# EAGLE design PCB-MIDDLE_FINAL (EAGLE 7.6.0)

## Sheet 1 of 2
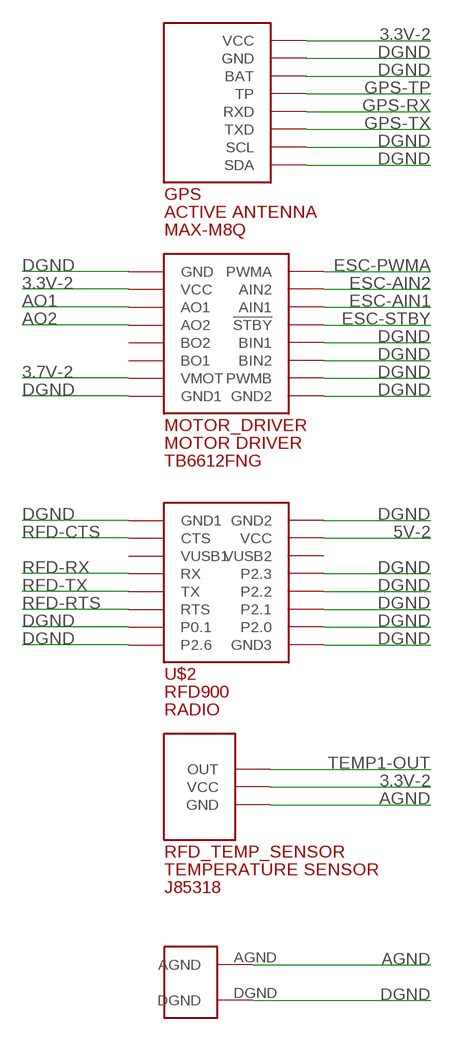
[diagram p0: schematic, sheet 1, part 1 of 2]
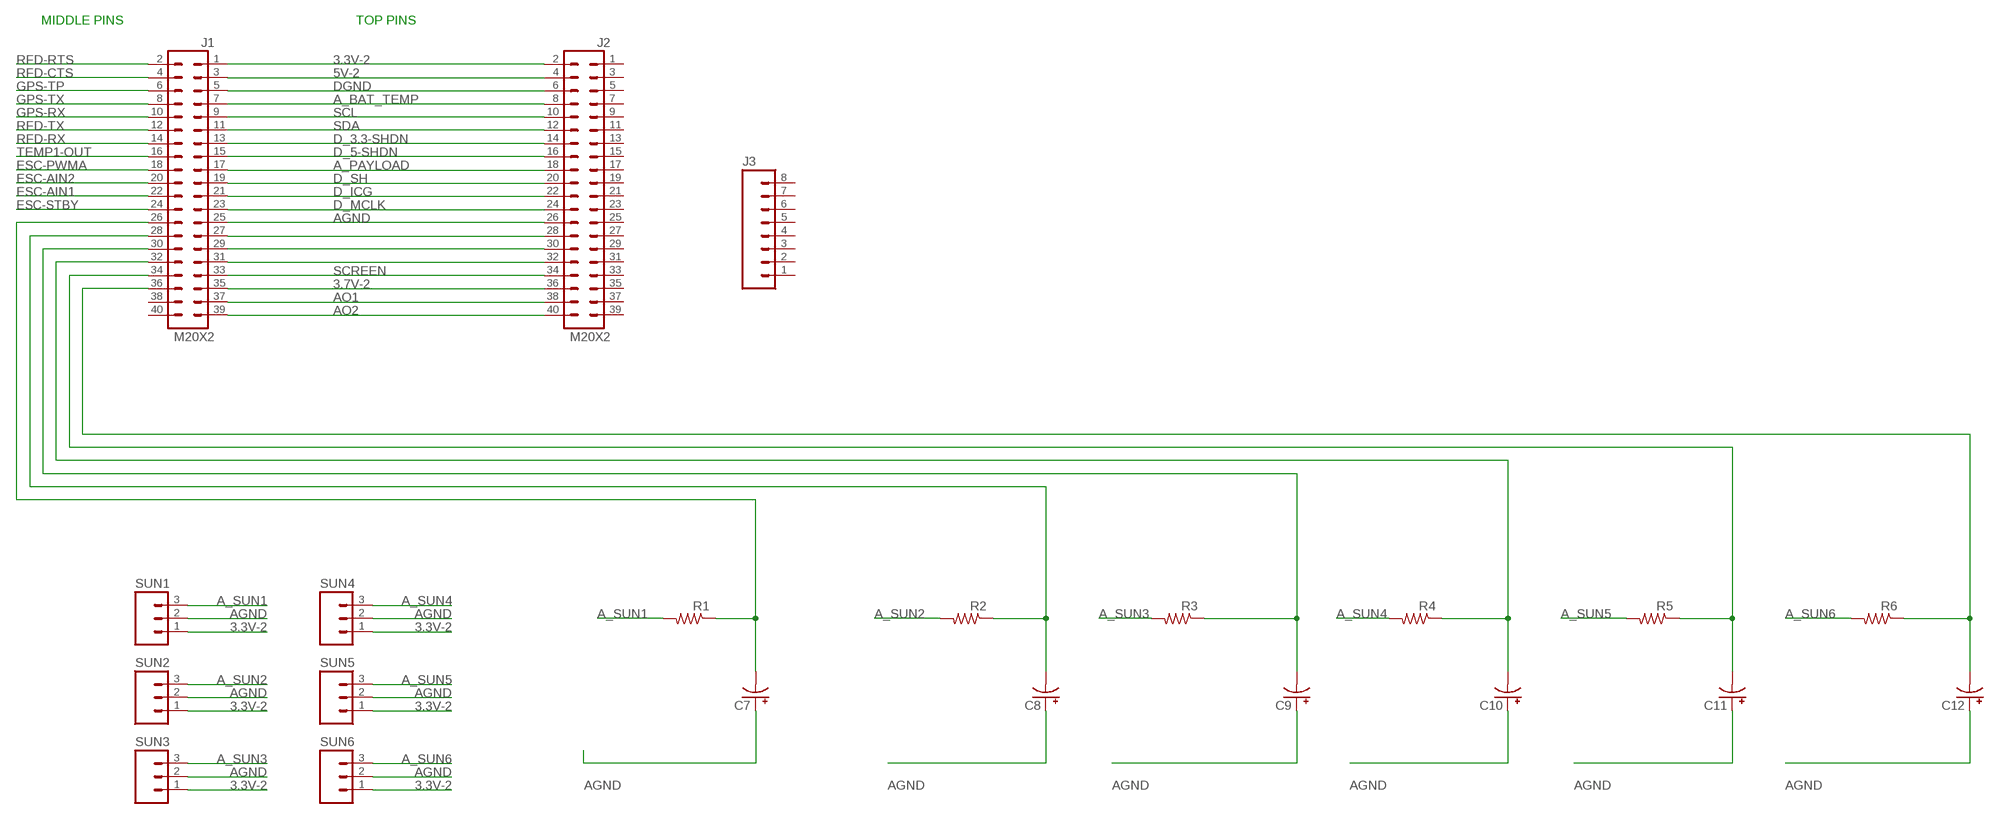
[diagram p1: schematic, sheet 1, part 2 of 2]

### Parts
C7  100UF-25V-20%(PTH)  [CPOL-RADIAL-100UF-25V]
C8  100UF-25V-20%(PTH)  [CPOL-RADIAL-100UF-25V]
C9  100UF-25V-20%(PTH)  [CPOL-RADIAL-100UF-25V]
C10  100UF-25V-20%(PTH)  [CPOL-RADIAL-100UF-25V]
C11  100UF-25V-20%(PTH)  [CPOL-RADIAL-100UF-25V]
C12  100UF-25V-20%(PTH)  [CPOL-RADIAL-100UF-25V]
GPS  MAX-M8QDIP8  [DIP8]
J1  M20X2  [2X20]
J2  M20X2  [2X20]
J3  M08  [1X08_ROUND]
MOTOR_DRIVER  MOTOR_DRIVER_DEV  [MOTOR_DRIVER]
R1  R-US_0204/5  [0204/5]
R2  R-US_0204/5  [0204/5]
R3  R-US_0204/5  [0204/5]
R4  R-US_0204/5  [0204/5]
R5  R-US_0204/5  [0204/5]
R6  R-US_0204/5  [0204/5]
RFD_TEMP_SENSOR  TEMP_SENSORDIP3  [DIP3]
SUN1  M03PTH  [1X03]
SUN2  M03PTH  [1X03]
SUN3  M03PTH  [1X03]
SUN4  M03PTH  [1X03]
SUN5  M03PTH  [1X03]
SUN6  M03PTH  [1X03]
U$1  GROUNDPLANECONNECTION_BOTTOM  [GROUNDPLANECONNECTION_BOTTOM]
U$2  RFD900  [RFD900_NEW]

### Nets
3.3V-2: GPS.VCC J1.1 J2.2 MOTOR_DRIVER.VCC RFD_TEMP_SENSOR.VCC SUN1.1 SUN2.1 SUN3.1 SUN4.1 SUN5.1 SUN6.1
3.7V-2: J1.35 J2.36 MOTOR_DRIVER.VMOT
5V-2: J1.3 J2.4 U$2.VCC
A_BAT_TEMP: J1.7 J2.8
A_PAYLOAD: J1.17 J2.18
A_SUN1: R1.2 SUN1.3
A_SUN2: R2.2 SUN2.3
A_SUN3: R3.2 SUN3.3
A_SUN4: R4.2 SUN4.3
A_SUN5: R5.2 SUN5.3
A_SUN6: R6.2 SUN6.3
AGND: C7.1(+) C8.1(+) C9.1(+) C10.1(+) C11.1(+) C12.1(+) J1.25 J2.26 RFD_TEMP_SENSOR.GND SUN1.2 SUN2.2 SUN3.2 SUN4.2 SUN5.2 SUN6.2 U$1.AGND
AO1: J1.37 J2.38 MOTOR_DRIVER.AO1
AO2: J1.39 J2.40 MOTOR_DRIVER.AO2
D_3.3-SHDN: J1.13 J2.14
D_5-SHDN: J1.15 J2.16
D_ICG: J1.21 J2.22
D_MCLK: J1.23 J2.24
D_SH: J1.19 J2.20
DGND: GPS.BATT(BAT) GPS.GND GPS.SCL GPS.SDA J1.5 J2.6 MOTOR_DRIVER.BIN1 MOTOR_DRIVER.BIN2 MOTOR_DRIVER.GND MOTOR_DRIVER.GND1 MOTOR_DRIVER.GND2 MOTOR_DRIVER.PWMB U$1.DGND U$2.GND1 U$2.GND2 U$2.GND3 U$2.P0.1 U$2.P2.0 U$2.P2.1 U$2.P2.2 U$2.P2.3 U$2.P2.6
ESC-AIN1: J1.22 MOTOR_DRIVER.AIN1
ESC-AIN2: J1.20 MOTOR_DRIVER.AIN2
ESC-PWMA: J1.18 MOTOR_DRIVER.PWMA
ESC-STBY: J1.24 MOTOR_DRIVER.!STBY
GPS-RX: GPS.RXD J1.10
GPS-TP: GPS.TP J1.6
GPS-TX: GPS.TXD J1.8
N$13: J1.27 J2.28
N$14: J1.29 J2.30
N$15: J1.31 J2.32
N$21: C7.2(-) J1.26 R1.1
N$22: C8.2(-) J1.28 R2.1
N$23: C9.2(-) J1.30 R3.1
N$24: C10.2(-) J1.32 R4.1
N$25: C11.2(-) J1.34 R5.1
N$26: C12.2(-) J1.36 R6.1
RFD-CTS: J1.4 U$2.CTS
RFD-RTS: J1.2 U$2.RTS
RFD-RX: J1.14 U$2.RX
RFD-TX: J1.12 U$2.TX
SCL: J1.9 J2.10
SCREEN: J1.33 J2.34
SDA: J1.11 J2.12
TEMP1-OUT: J1.16 RFD_TEMP_SENSOR.OUT
Unconnected: J1.38 J1.40 J2.1 J2.3 J2.5 J2.7 J2.9 J2.11 J2.13 J2.15 J2.17 J2.19 J2.21 J2.23 J2.25 J2.27 J2.29 J2.31 J2.33 J2.35 J2.37 J2.39 J3.1 J3.2 J3.3 J3.4 J3.5 J3.6 J3.7 J3.8 MOTOR_DRIVER.BO1 MOTOR_DRIVER.BO2 U$2.VUSB1 U$2.VUSB2

### Notes on the sheet
- MIDDLE PINS | TOP PINS

## Sheet 2 of 2

## Library data of the parts
C7-C12 = SparkFun-Capacitors:100UF-25V-20%(PTH): CAP-08439; PROD_ID: CAP-08439
GPS = GPS:MAX-M8Q
J1 J2 = SparkFun-Connectors:M20X2: 0.1" spaced headers
J3 = SparkFun-Connectors:M08: Header 8 Standard 8-pin 0.1" header. Use with straight break away headers (SKU : PRT-00116), right angle break away headers (PRT-00553), swiss pins (PRT-00743), machine pins (PRT-00117), and female headers (PRT-00115).; PROD_ID: CONN-08437
MOTOR_DRIVER = Motor_Driver_TB6612FNG:MOTOR_DRIVER_DEV
R1-R6 = resistor:R-US_: RESISTOR, American symbol
RFD_TEMP_SENSOR = Temp_Sensor_K853518:TEMP_SENSOR
SUN1-SUN6 = SparkFun-Connectors:M03: Header 3 Standard 3-pin 0.1" header. Use with straight break away headers (SKU : PRT-00116), right angle break away headers (PRT-00553), swiss pins (PRT-00743), machine pins (PRT-00117), and female headers (PRT-00115). Molex polarized connector foot print use with SKU : PRT-08232 with associated crimp pins and housings.
U$1 = BOTTOM_Groundplaneconnection:GROUNDPLANECONNECTION_BOTTOM
U$2 = RFD900:RFD900

## Board
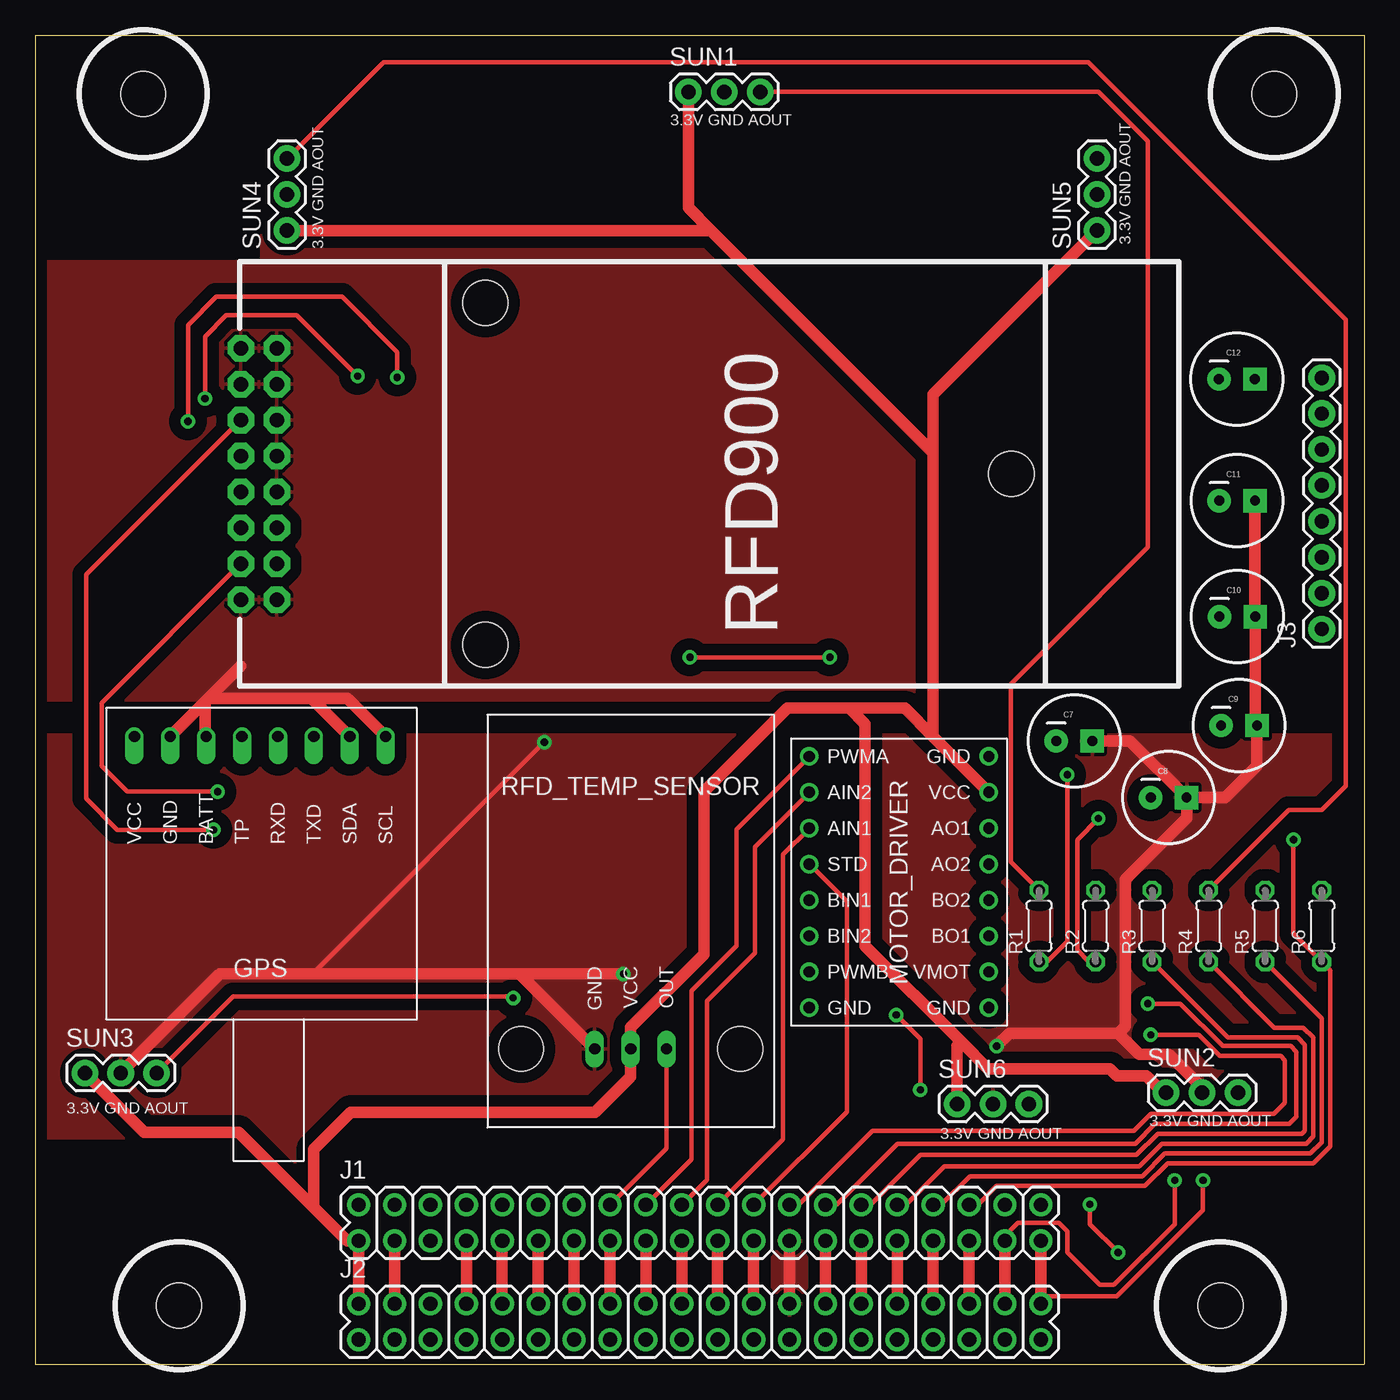
[diagram p2: board, top side]
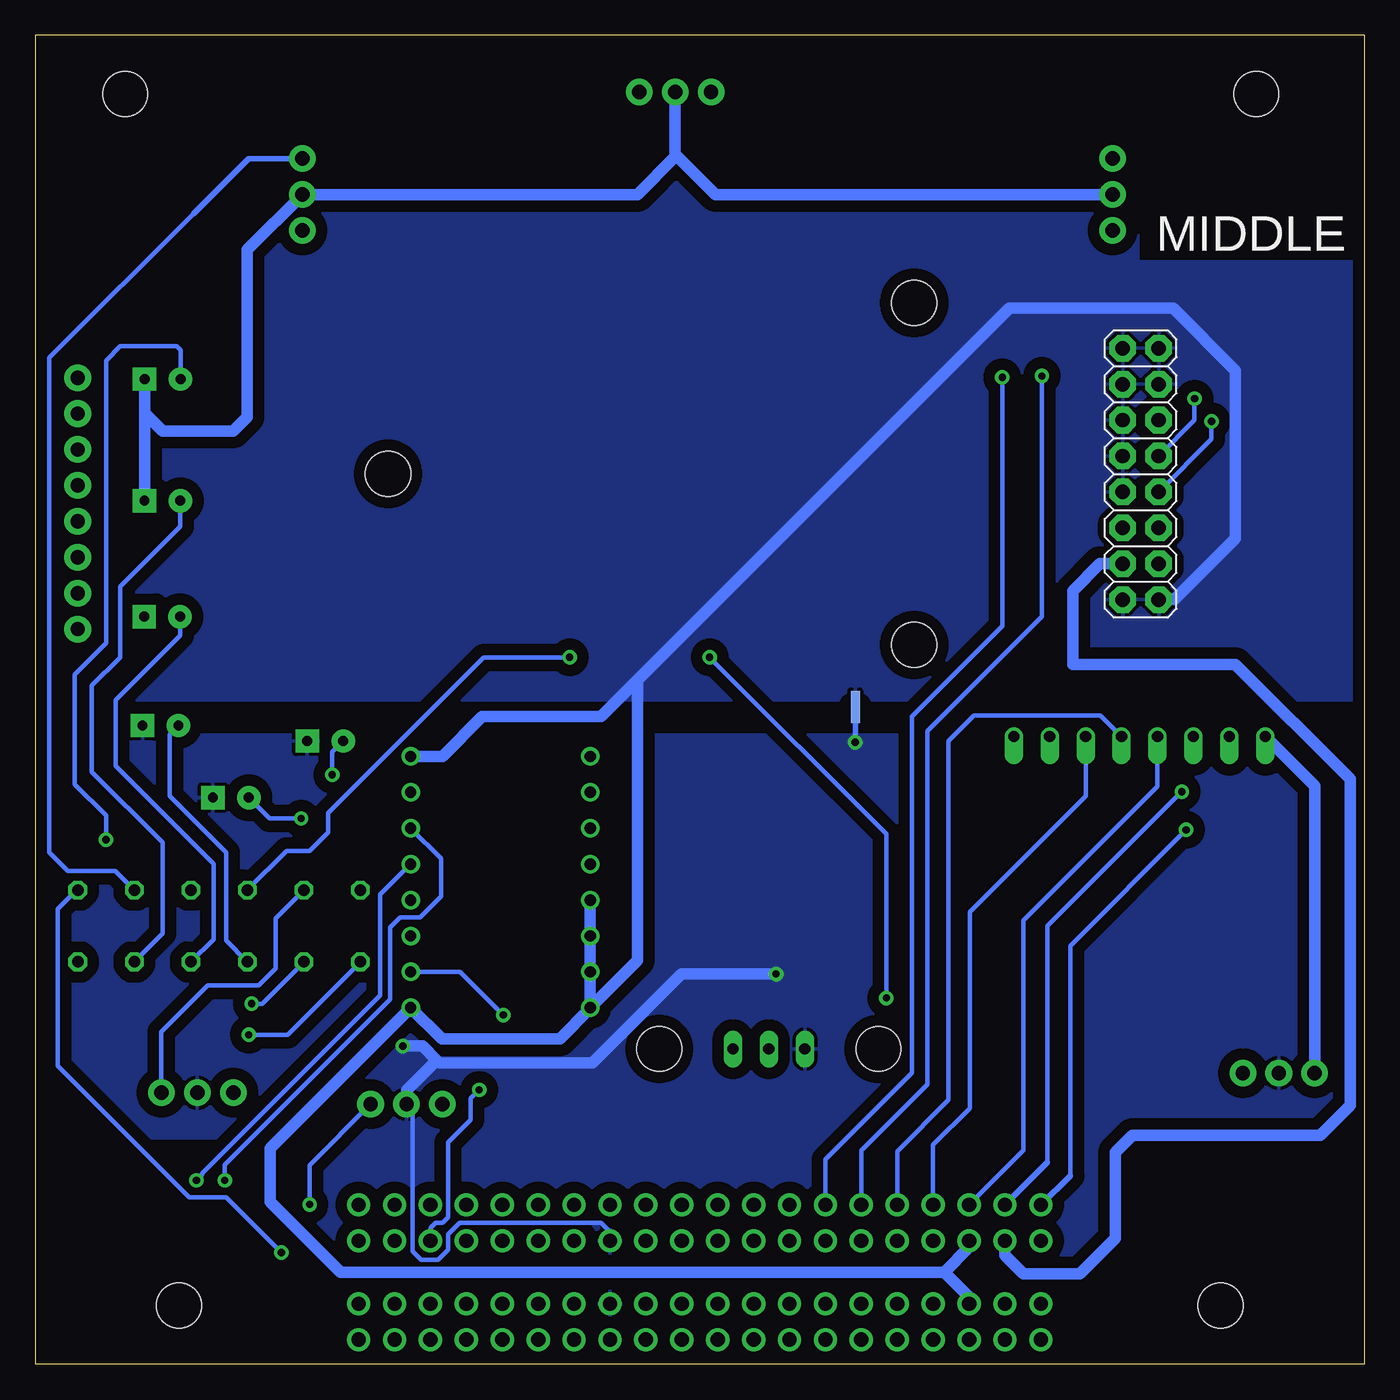
[diagram p3: board, bottom side, seen from below]

Size 94 x 94 mm. Coordinates in mm from the lower left corner, seen from the top.
Outline: 0,0 94,0 94,94 0,94 0,0
Copper layers (1*16): Top 0.035mm / dielectric 1.5mm / Bottom 0.035mm
Design rules "SparkFun-2-layer-STANDARD": minimum track width 10mil, minimum drill 20mil, track to track 10mil, track to pad 8mil, pad to pad 8mil, via to via 10mil, smd to smd 8mil, copper to edge 8mil, drill to drill 8mil, minimum pad ring 10mil, minimum via ring 10mil, stop-mask expansion 4mil, vias tented up to drill 25mil, thermal gap 10mil
Holes 3.18 mm at 7.63,89.86 87.64,89.86 83.83,4.13 10.17,4.13

### Footprints (pad centres in the part's own frame; a part is rotated, then mirrored left to right if it is on the bottom)
CPOL-RADIAL-100UF-25V = drill 0.7 pad 1.651 square: 1 1.27,0 | drill 0.7 pad 1.651: 2 -1.27,0
DIP8 = drill 0.8 offset: BATT 0,-5.08; GND 0,-2.54; RXD 0,-10.16; SCL 0,-17.78; SDA 0,-15.24; TP 0,-7.62; TXD 0,-12.7; VCC 0,0
2X20 = drill 1.016 pad 1.651: 1 -24.13,-1.27; 2 -24.13,1.27; 3 -21.59,-1.27; 4 -21.59,1.27; 5 -19.05,-1.27; 6 -19.05,1.27; 7 -16.51,-1.27; 8 -16.51,1.27; 9 -13.97,-1.27; 10 -13.97,1.27; 11 -11.43,-1.27; 12 -11.43,1.27; 13 -8.89,-1.27; 14 -8.89,1.27; 15 -6.35,-1.27; 16 -6.35,1.27; 17 -3.81,-1.27; 18 -3.81,1.27; 19 -1.27,-1.27; 20 -1.27,1.27; 21 1.27,-1.27; 22 1.27,1.27; 23 3.81,-1.27; 24 3.81,1.27; 25 6.35,-1.27; 26 6.35,1.27; 27 8.89,-1.27; 28 8.89,1.27; 29 11.43,-1.27; 30 11.43,1.27; 31 13.97,-1.27; 32 13.97,1.27; 33 16.51,-1.27; 34 16.51,1.27; 35 19.05,-1.27; 36 19.05,1.27; 37 21.59,-1.27; 38 21.59,1.27; 39 24.13,-1.27; 40 24.13,1.27
1X08_ROUND = drill 1.016 pad 1.88: 1 0,0; 2 2.54,0; 3 5.08,0; 4 7.62,0; 5 10.16,0; 6 12.7,0; 7 15.24,0; 8 17.78,0
MOTOR_DRIVER = drill 0.8: !STBY -6.35,1.27; AIN1 -6.35,3.81; AIN2 -6.35,6.35; AO1 6.35,3.81; AO2 6.35,1.27; BIN1 -6.35,-1.27; BIN2 -6.35,-3.81; BO1 6.35,-3.81; BO2 6.35,-1.27; GND 6.35,8.89; GND1 6.35,-8.89; GND2 -6.35,-8.89; PWMA -6.35,8.89; PWMB -6.35,-6.35; VCC 6.35,6.35; VMOT 6.35,-6.35
0204/5 = drill 0.813 octagon: 1 -2.54,0; 2 2.54,0
DIP3 = drill 0.8 long: GND -3.02,-2.54; OUT -3.02,2.54; VCC -3.02,0 | hole 3.175: -3.02,7.75; -3.02,-7.75
1X03 = drill 1.016 pad 1.88: 1 0,0; 2 2.54,0; 3 5.08,0
GROUNDPLANECONNECTION_BOTTOM = smd 1.27 x 0.635 bottom: AGND -1,0; DGND 0,0
RFD900_NEW = drill 1.016 pad 1.88 octagon: CTS 21.36,0.1; GND1 23.9,0.1; GND2 23.9,2.64; GND3 6.12,2.64; P0.1 8.66,0.1; P2.0 8.66,2.64; P2.1 11.2,2.64; P2.2 13.74,2.64; P2.3 16.28,2.64; P2.6 6.12,0.1; RTS 11.2,0.1; RX 16.28,0.1; TX 13.74,0.1; VCC 21.36,2.64; VUSB1 18.82,0.1; VUSB2 18.82,2.64 | hole 3.2: 2.9,17.4; 27.1,17.4; 15,54.6

### Placement (x,y rotation side)
C7  73.49,44.08 0 top
C8  80.17,40.08 0 top
C9  85.15,45.18 0 top
C10  85.03,52.88 0 top
C11  85.01,61.08 0 top
C12  85,69.68 0 top
GPS  7,44.4 90 top
J1  47,10 0 top
J2  47,3 0 top
J3  91,52 90 top
MOTOR_DRIVER  61.1,34.1 0 top
R1  71,31 90 top
R2  75,31 90 top
R3  79,31 90 top
R4  83,31 90 top
R5  87,31 90 top
R6  91,31 90 top
RFD_TEMP_SENSOR  42.11,19.28 270 top
SUN1  46.2,90 0 top
SUN2  80,19.2 0 top
SUN3  3.5,20.6 0 top
SUN4  17.8,80.2 90 top
SUN5  75.1,80.2 90 top
SUN6  65.2,18.4 0 top
U$1  36,47 90 top
U$2  14.44,77.98 270 top

### Tracks (layer width: path | path; a pad name or v marks a point on that pad's centre or on a via)
3.3V-2
  Top 0.813: J2.2 J1.1 22.07,8.73 21,9.8 19.7,11.1 | 19.7,11.1 19.7,15.2 22.3,17.8 39.6,17.8 42.11,20.31 RFD_TEMP_SENSOR.VCC 42.11,23.81 47.3,29 47.3,40.5 53.2,46.4 57.6,46.4 | SUN1.1 46.2,81.8 47.8,80.2 | SUN4.1 47.8,80.2 | SUN2.1 79.8,19.2 78.6,20.4 76.5,20.4 76,20.9 67.4,20.9 65.5,22.8 | 65.5,22.8 58.7,29.6 58.7,45.3 57.6,46.4 | SUN6.1 65.2,22.5 65.5,22.8 | 63.5,64.5 63.5,44.4 | SUN3.1 7.7,16.4 14.4,16.4 19.7,11.1 | 57.6,46.4 61.5,46.4 63.5,44.4 | 63.5,64.5 47.8,80.2 | 63.5,64.5 63.5,68.6 SUN5.1 | 63.5,44.4 MOTOR_DRIVER.VCC
  Bottom 0.813: GPS.VCC 3.5,40.9 SUN3.1
3.7V-2  (via drill 0.51)
  Top 0.305: v62.6,19.4 62.6,23 v60.9,24.7
  Top 0.813: J2.36 J1.35
  Bottom 0.305: J1.35 66.05,9.65 65.7,10 65.2,10 64.8,10.4 64.8,15.7 63.2,17.3 63.2,18.8 v62.6,19.4 | v60.9,24.7 63.95,27.75 MOTOR_DRIVER.VMOT
5V-2
  Top 0.813: J1.3 J2.4
  Bottom 0.813: J1.3 25.41,7.71 24.1,6.4 20.1,6.4 17.6,8.9 17.6,15 16.4,16.2 3.1,16.2 1,18.3 1,41.4 9.1,49.5 20.6,49.5 20.6,52.8 20.6,53.1 20.6,54.7 18.68,56.62 U$2.VCC
A_BAT_TEMP
  Top 0.813: J2.8 J1.7
A_PAYLOAD
  Top 0.813: J1.17 J2.18
A_SUN1
  Top 0.305: R1.2 69,35.54 69,48.1 70.75,49.85 72,51.1 78.7,57.8 78.7,86.5 75.2,90 SUN1.3
A_SUN2
  Bottom 0.305: SUN2.3 85.08,23.52 81.8,26.8 78.2,26.8 77,28 77,31.54 R2.2
A_SUN3  (via drill 0.51)
  Top 0.305: v33.8,25.9 33.7,26 13.98,26 SUN3.3 | v46.3,50 v56.2,50
  Bottom 0.305: R3.2 76.24,36.3 74.6,36.3 73.3,37.6 73.3,39 62.3,50 v56.2,50 | v46.3,50 33.8,37.5 v33.8,25.9
A_SUN4
  Top 0.305: 17.88,85.2 SUN4.3 24.62,92.1 74.5,92.1 92.7,73.9 92.7,40.9 91,39.2 88.66,39.2 R4.2
A_SUN5
  Bottom 0.305: R5.2 88.36,34.9 91.7,34.9 93,36.2 93,71.2 82.8,81.4
  Bottom 0.406: 82.8,81.4 78.92,85.28 SUN5.3
A_SUN6  (via drill 0.51)
  Top 0.305: v74.6,11.3 74.6,9.9 v76.6,7.9
  Bottom 0.305: R6.2 91.04,33.5 91.1,33.5 92.4,32.2 92.4,21.1 83.1,11.8 80.5,11.8 v76.6,7.9 | 70.38,18.3 SUN6.3 74.6,14.08 v74.6,11.3
AGND  (via drill 0.51)
  Top 0.305: v36,44 19.6,27.6 17,27.6
  Top 0.813: J2.26 J1.25 | SUN2.2 82.54,19.56 80.2,21.9 78.1,21.9 76.6,23.4 | 76.6,23.4 68.9,23.4 v68,22.5 | 34.27,27.6 RFD_TEMP_SENSOR.GND | 34.27,27.6 v41.6,27.6 | SUN3.2 13.04,27.6 17,27.6 34.27,27.6 | C7.1 77.44,44.08 C8.1 | C8.1 84.18,40.08 86.4,42.3 86.4,45.16 C9.1 86.3,45.18 C10.1 86.28,52.88 C11.1 | C8.1 81.44,38.64 77.1,34.3 77.1,23.9 76.6,23.4
  Bottom 0.305: 53.35,9.15 53.35,9.35 54,10 64,10 64.8,9.2 64.8,8.1 65.5,7.4 66.7,7.4 67.3,8 67.3,17.96 SUN6.2
  Bottom 0.406: J1.25 53.35,9.15 | U$1.AGND v36,44
  Bottom 0.813: SUN1.2 48.74,85.6 | 48.74,85.6 48.74,85.4 51.4,82.74 SUN5.2 79,78.84 79,67 80,66 85,66 86.27,67.27 C12.1 C11.1 | v68,22.5 66.6,22.5 65.6,21.5 | 65.6,21.5 65.4,21.3 54.6,21.3 48.3,27.6 v41.6,27.6 | SUN6.2 67.74,19.36 65.6,21.5 | SUN4.2 45.88,82.74 48.74,85.6
  pour Bottom (isolate 0.813): 0,16 16,16 16,0 78,0 78,16 94,16 94,44.5 0,44.5
  pour Top (isolate 0.813): 0,16 16,16 16,0 78,0 78,16 94,16 94,44.5 0,44.5
AO1  (via drill 0.51)
  Top 0.305: J1.37 68.59,9.09 69.5,10 72.4,10 73,9.4 73,7.9 75.3,5.6 76.3,5.6 80.6,9.9 v80.6,13
  Top 0.813: J1.37 J2.38
  Bottom 0.305: v80.6,13 80.6,14.1 68.9,25.8 68.9,30.9 68.2,31.6 66.8,31.6 65.3,33.1 65.3,35.76 MOTOR_DRIVER.AO1
AO2  (via drill 0.51)
  Top 0.305: J1.39 71.27,8.73 | J2.40 71.66,4.8 76.5,4.8 82.6,10.9 v82.6,13
  Top 0.813: J1.39 J2.40
  Bottom 0.305: v82.6,13 82.2,13.4 82.2,13.5 69.6,26.1 69.6,33.22 MOTOR_DRIVER.AO2
D_3.3-SHDN
  Top 0.813: J1.13 J2.14
D_5-SHDN
  Top 0.813: J1.15 J2.16
D_ICG
  Top 0.813: J1.21 J2.22
D_MCLK
  Top 0.813: J1.23 J2.24
D_SH
  Top 0.813: J1.19 J2.20
DGND
  Top 0.813: GPS.GND 12.02,46.88 | 12.02,46.88 12.22,47.08 | 12.22,47.08 14.54,49.4 | GPS.SDA 19.56,47.08 | 19.56,47.08 12.22,47.08 | GPS.SCL 22.1,47.08 19.56,47.08 | GPS.BATT 12.02,44.46 12.02,46.88
  Bottom 0.813: 29.7,6.5 27.95,8.25 J1.5 | 29.7,6.5 72.4,6.5 77.4,11.5 77.4,15.26 MOTOR_DRIVER.GND1 65.24,23 56.9,23 54.75,25.15 MOTOR_DRIVER.GND2 | 51.4,48.4 25.1,74.7 13.5,74.7 9.1,70.3 9.1,58.4 13.42,54.08 | 51.4,48.4 51.4,28.56 MOTOR_DRIVER.GND2 | MOTOR_DRIVER.GND 65.2,43 62.4,45.8 54,45.8 51.4,48.4 | MOTOR_DRIVER.GND2 MOTOR_DRIVER.PWMB MOTOR_DRIVER.BIN2 MOTOR_DRIVER.BIN1 | 29.7,6.5 27.95,4.75 J2.6
  pour Bottom (isolate 0.813): 0,78 16,78 16,94 78,94 78,78 94,78 94,47 0,47
  pour Top (isolate 0.813): 0,78 16,78 16,94 78,94 78,78 94,78 94,47 0,47
ESC-AIN1
  Top 0.305: MOTOR_DRIVER.AIN1 52.9,36.06 52.9,15.9 J1.22
ESC-AIN2
  Top 0.305: MOTOR_DRIVER.AIN2 50.9,36.6 50.9,29.1 47.5,25.7 47.5,13.04 J1.20
ESC-PWMA
  Top 0.305: J1.18 46.4,14.48 46.4,26.4 49.6,29.6 49.6,37.84 MOTOR_DRIVER.PWMA
ESC-STBY
  Top 0.305: MOTOR_DRIVER.!STBY 57.4,32.72 57.4,17.86 J1.24
GPS-RX
  Bottom 0.305: J1.10 33.03,15.07 29.4,18.7 29.4,44.1 27.6,45.9 18.66,45.9 GPS.RXD
GPS-TP
  Bottom 0.305: J1.6 24.1,15.12 24.1,31.4 14.62,40.88 GPS.TP
GPS-TX
  Bottom 0.305: J1.8 30.49,15.51 27.9,18.1 27.9,32 19.7,40.2 GPS.TXD
N$13
  Top 0.813: J1.27 J2.28
N$14
  Top 0.813: J1.29 J2.30
N$15
  Top 0.813: J1.31 J2.32
N$21  (via drill 0.51)
  Top 0.305: J1.26 53.97,11.27 59.2,16.5 77.7,16.5 78.9,17.7 87.6,17.7 88.4,18.5 88.4,21.5 88.1,21.8 83.8,21.8 82.3,23.3 v78.9,23.3 | R1.1 71.56,28.46 73,29.9 v73,41.7
  Bottom 0.305: 73,41.6 v73,41.7 73,43.3 C7.2 | R1.1 76.16,23.3 v78.9,23.3
N$22  (via drill 0.51)
  Top 0.305: J1.28 56.67,11.27 61,15.6 77.8,15.6 79.2,17 88.7,17 89.2,17.5 89.2,22.1 88.8,22.5 84,22.5 81,25.5 v78.7,25.5 | R2.1 74.54,28.46 73.7,29.3 73.7,37.1 v75.2,38.6
  Bottom 0.305: v78.7,25.5 77.96,25.5 R2.1 | v75.2,38.6 77.42,38.6 C8.2
N$23
  Top 0.305: J1.30 59.07,11.27 62.6,14.8 77.9,14.8 79.4,16.3 89.6,16.3 89.8,16.5 89.8,22.6 89.3,23.1 84.36,23.1 R3.1
  Bottom 0.305: R3.1 80.5,29.96 80.5,36.2 84.5,40.2 84.5,44.56 C9.2
N$24
  Top 0.305: J1.32 61.57,11.27 64.3,14 78.1,14 79.7,15.6 89.9,15.6 90.4,16.1 90.4,23.1 89.7,23.8 87.66,23.8 R4.1
  Bottom 0.305: R4.1 81.4,30.06 81.4,35.4 88.3,42.3 88.3,47 83.76,51.54 C10.2
N$25
  Top 0.305: J1.34 64.07,11.27 66.1,13.3 78.3,13.3 79.9,14.9 90.2,14.9 91,15.7 91,24.46 R5.1
  Bottom 0.305: R5.1 85,30.46 85,36.9 90,41.9 90,48 88,50 88,55 83.74,59.26 C11.2
N$26  (via drill 0.51)
  Top 0.305: J1.36 66.67,11.27 68,12.6 78.5,12.6 80.1,14.2 90.4,14.2 91.6,15.4 91.6,27.86 R6.1 89,30.46 v89,37.1
  Bottom 0.305: v89,37.1 89,38.8 91.2,41 91.2,48.8 89,51 89,71 88,72 84,72 83.73,71.73 C12.2
RFD-CTS  (via drill 0.51)
  Top 0.305: v12.9,40.5 6.5,40.5 4.7,42.3 4.7,46.78 U$2.CTS
  Bottom 0.305: J1.4 25.41,11.39 | 22.4,14.28 22.4,31 v12.9,40.5
  Bottom 0.406: 22.4,14.28 J1.4
RFD-RTS  (via drill 0.51)
  Top 0.305: v12.6,37.8 5.8,37.8 3.6,40 3.6,55.84 U$2.RTS
  Bottom 0.305: 20.8,13.34 20.8,29.6 v12.6,37.8
  Bottom 0.406: 20.8,13.34 J1.2
RFD-RX  (via drill 0.51)
  Top 0.305: v25.6,69.8 25.6,71.6 21.7,75.5 12.8,75.5 10.8,73.5 v10.8,66.7
  Bottom 0.305: J1.14 38.11,14.49 32,20.6 32,45.8 25.6,52.2 v25.6,69.8 | v10.8,66.7 10.8,65.44 U$2.RX
RFD-TX  (via drill 0.51)
  Top 0.305: v22.8,69.9 18.5,74.2 13.5,74.2 12,72.7 v12,68.3
  Bottom 0.305: J1.12 35.57,15.13 30.9,19.8 30.9,44.8 22.8,52.9 v22.8,69.9 | v12,68.3 12,66.78 U$2.TX
SCL
  Top 0.813: J2.10 J1.9
SCREEN
  Top 0.813: J1.33 J2.34
SDA
  Top 0.813: J2.12 J1.11
TEMP1-OUT
  Top 0.305: RFD_TEMP_SENSOR.OUT 44.65,15.27 J1.16

### Text on the board
tPlace: 3.3V GND AOUT | 3.3V GND AOUT | 3.3V GND AOUT | 3.3V GND AOUT | 3.3V GND AOUT | 3.3V GND AOUT
bPlace: MIDDLE